# Altium project XDS100V2.PrjPcb
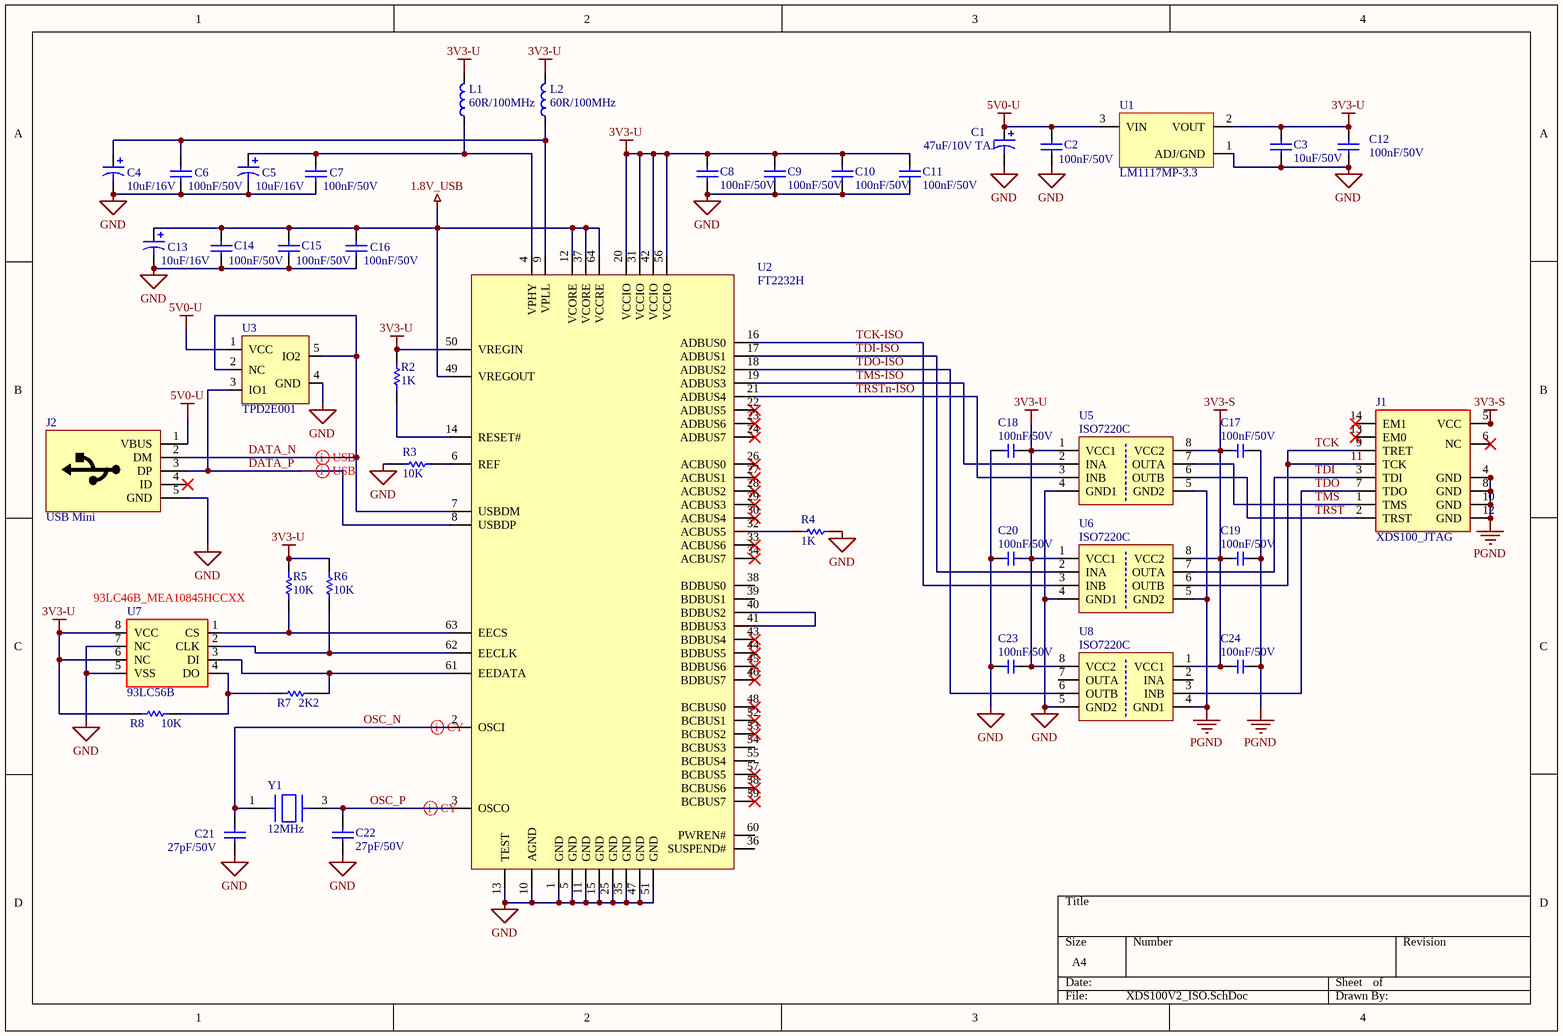
[diagram p0: XDS100V2_ISO.SchDoc]
1 sheet, 43 parts. Net scope: global (net labels, ports and power ports of the same name join across sheets).
Board file: PCB.PcbDoc

## Sheet XDS100V2_ISO.SchDoc
size A4

### Parts
C1  47uF/10V TAJ  [TAJ]
C2  100nF/50V  [CC0805]
C3  10uF/50V  [CC0805]
C4  10uF/16V  [Tantaium Cap A]
C5  10uF/16V  [Tantaium Cap A]
C6  100nF/50V  [CC0805]
C7  100nF/50V  [CC0805]
C8  100nF/50V  [CC0805]
C9  100nF/50V  [CC0805]
C10  100nF/50V  [CC0805]
C11  100nF/50V  [CC0805]
C12  100nF/50V  [CC0805]
C13  10uF/16V  [Tantaium Cap A]
C14  100nF/50V  [CC0805]
C15  100nF/50V  [CC0805]
C16  100nF/50V  [CC0805]
C17  100nF/50V  [CC0805]
C18  100nF/50V  [CC0805]
C19  100nF/50V  [CC0805]
C20  100nF/50V  [CC0805]
C21  27pF/50V  [CC0805]
C22  27pF/50V  [CC0805]
C23  100nF/50V  [CC0805]
C24  100nF/50V  [CC0805]
J1  XDS100_JTAG  [XDS100_JTAG]
J2  USB Mini  [USB_MINI]
L1  60R/100MHz  [CL0805]
L2  60R/100MHz  [CL0805]
R2  1K  [CR0805]
R3  10K  [CR0805]
R4  1K  [CR0805]
R5  10K  [CR0805]
R6  10K  [CR0805]
R7  2K2  [CR0805]
R8  10K  [CR0805]
U1  LM1117MP-3.3  [SOT223]
U2  FT2232H  [LQFP-64]
U3  TPD2E001  [DRL(R-PDSO-N5)]
U5  ISO7220C  [SOIC08]
U6  ISO7220C  [SOIC08]
U7  93LC56B  [SOIC08]
U8  ISO7220C  [SOIC08]
Y1  12MHz  [EXC3225]

### Nets
1.8V_USB: C13.1(DC+) C14.2 C15.2 C16.2 U2.12(VCORE) U2.37(VCORE) U2.49(VREGOUT) U2.64(VCCRE)
3V3-S: C17.1 C19.1 C24.1 J1.5(VCC) U5.8(VCC2) U6.8(VCC2) U8.1(VCC1)
3V3-U: C3.2 C8.2 C9.2 C10.2 C11.2 C12.2 C18.2 C20.2 C23.2 L1.2 L2.2 R2.2 R5.2 R6.2 R8.1 U1.2(VOUT) U2.20(VCCIO) U2.31(VCCIO) U2.42(VCCIO) U2.50(VREGIN) U2.56(VCCIO) U5.1(VCC1) U6.1(VCC1) U7.6(NC) U7.8(VCC) U8.8(VCC2)
5V0-U: C1.1 C2.2 J2.1(VBUS) U1.3(VIN) U3.1(VCC)
GND: C1.2 C2.1 C3.1 C4.2(DC-) C5.2(DC-) C6.1 C7.1 C8.1 C9.1 C10.1 C11.1 C12.1 C13.2(DC-) C14.1 C15.1 C16.1 C18.1 C20.1 C21.1 C22.1 C23.1 J2.0(SH) J2.5(GND) R3.2 R4.2 U1.1(ADJ/GND) U2.1(GND) U2.5(GND) U2.10(AGND) U2.11(GND) U2.13(TEST) U2.15(GND) U2.25(GND) U2.35(GND) U2.47(GND) U2.51(GND) U3.4(GND) U5.4(GND1) U6.4(GND1) U7.5(VSS) U7.7(NC) U8.5(GND2)
PGND: C17.2 C19.2 C24.2 J1.4(GND) J1.8(GND) J1.10(GND) J1.12(GND) U5.5(GND2) U6.5(GND2) U8.4(GND1)
DATA_N: J2.2(DM) U2.7(USBDM) U3.2(NC) U3.5(IO2)
DATA_P: J2.3(DP) U2.8(USBDP) U3.3(IO1)
OSC_N: C21.2 U2.2(OSCI) Y1.1
OSC_P: C22.2 U2.3(OSCO) Y1.3
TCK: J1.9(TRET) J1.11(TCK) U6.6(OUTB)
TCK-ISO: U2.16(ADBUS0) U6.3(INB)
TDI: J1.3(TDI) U6.7(OUTA)
TDI-ISO: U2.17(ADBUS1) U6.2(INA)
TDO: J1.7(TDO) U8.3(INB)
TDO-ISO: U2.18(ADBUS2) U8.6(OUTB)
TMS: J1.1(TMS) U5.7(OUTA)
TMS-ISO: U2.19(ADBUS3) U5.2(INA)
TRST: J1.2(TRST) U5.6(OUTB)
TRSTn-ISO: U2.21(ADBUS4) U5.3(INB)
NetC4_1: C4.1(DC+) C6.2 L2.1 U2.9(VPLL)
NetC5_1: C5.1(DC+) C7.2 L1.1 U2.4(VPHY)
NetR2_1: R2.1 U2.14(RESET#)
NetR3_1: R3.1 U2.6(REF)
NetR4_1: R4.1 U2.32(ACBUS5)
NetR5_1: R5.1 U2.63(EECS) U7.1(CS)
NetR6_1: R6.1 U2.62(EECLK) U7.2(CLK)
NetR7_1: R7.1 R8.2 U7.4(DO)
NetR7_2: R7.2 U2.61(EEDATA) U7.3(DI)
NetU2_40: U2.40(BDBUS2) U2.41(BDBUS3)

Not connected (* = marked no-connect by the designer): J1 6(NC)* 13(EM0)* 14(EM1)*; J2 4(ID)*; U2 22(ADBUS5)* 23(ADBUS6)* 24(ADBUS7)* 26(ACBUS0)* 27(ACBUS1)* 28(ACBUS2)* 29(ACBUS3)* 30(ACBUS4)* 33(ACBUS6)* 34(ACBUS7)* 36(SUSPEND#) 38(BDBUS0) 39(BDBUS1) 43(BDBUS4)* 44(BDBUS5)* 45(BDBUS6)* 46(BDBUS7)* 48(BCBUS0)* 52(BCBUS1)* 53(BCBUS2)* 54(BCBUS3) 55(BCBUS4) 57(BCBUS5)* 58(BCBUS6)* 59(BCBUS7)* 60(PWREN#); U8 2(INA) 7(OUTA)

### Layout directives
differential pair: DATA_N, DATA_P, OSC_N, OSC_P

### Notes on the sheet
- (near U7) 93LC46B_MEA10845HCCXX

### Library data of the parts
C1 = 47uF/10V TAJ: Polarized Capacitor (Axial); Data Sheet: TAJ.pdf; SSTC PN.: MEC30041XRXX; MA.: *; Price (NTD): 2.99; Component Type: tantalum solid electrolytic capacitors; Package: *; MA.2: *; Value: 47uF/10V TAJ
C2 C6-C11 C14-C20 C23 C24 = 100nF/50V: Capacitor (Semiconductor SIM Model); SSTC PN.: MEC00390YDXX; Data Sheet: CC.pdf; MA.: *; Price (NTD): 0.08; Package: SMA0805; MA.2: *; Component Type: chip capacitors; Value: 100nF/50V
C3 = 10uF/50V: Capacitor (Semiconductor SIM Model); Data Sheet: CC.pdf; MA.: *; Price (NTD): *; Package: SMA0805; MA.2: *; SSTC PN.: *; Component Type: chip capacitors; Value: 10uF/50V
C4 C5 C13 = 10uF/16V: Polarized Capacitor (Axial); SSTC PN.: MEC300113CXX; Data Sheet: Tantalum Capactor.pdf; Package: SMA A class; Price (NTD): 1.5; MA.2: *; MA.: *; Component Type: tantalum solid electrolytic capacitors; Value: 10uF/16V
C12 = 100nF/50V: Capacitor (Semiconductor SIM Model); Data Sheet: CC.pdf; MA.: *; Price (NTD): *; Package: SMA0805; MA.2: *; SSTC PN.: *; Component Type: chip capacitors; Value: 100nF/50V
C21 C22 = 27pF/50V: Capacitor (Semiconductor SIM Model); Data Sheet: CC.pdf; MA.: *; Price (NTD): *; Package: SMA0805; MA.2: *; SSTC PN.: *; Component Type: chip capacitors; Value: 27pF/50V
J1 = XDS100_JTAG: Data Sheet: �ȭZ2.54�ưw���y.pdf; MA.: �ȭZ; Price (NTD): *; MA.2: *; SSTC PN.: *; Package: *; Component Type: Connector; Value: XDS100_JTAG
J2 = USB Mini: Data Sheet: mini usb spec.pdf; MA.: �ȼw��; SSTC PN.: MEX1134GH0XX; Component Type: Connector; MA. 2: *; Package: SMA; Price (NTD): 3.6; Value: USB Mini
L1 L2 = 60R/100MHz: Inductor; SSTC PN.: MEI0020NN8XX; Data Sheet: BKP2125HS600P.pdf; MA.: BKP2125HS600-T; Package: SMA 0805; Price (NTD): 0.18; MA.2: *; Component Type: Inductor; Value: 60R/100MHz
R2 R4 = 1K: Resistor; SSTC PN.: MER1022K66XX; Data Sheet: CR.pdf; Price (NTD): 0.04; Package: SMA 0805; MA.: *; MA.2: *; Component Type: chip resistor; Value: 1K
R3 R5 R6 R8 = 10K: Resistor; SSTC PN.: MER1106K6CXX; Data Sheet: CR.pdf; Price (NTD): 0.03; Package: SMA 0805; MA.: *; MA.2: *; Component Type: chip resistor; Value: 10K
R7 = 2K2: Resistor; Data Sheet: CR.pdf; SSTC PN.: *; Price (NTD): 0.03; Package: SMA0805; MA.: *; MA.2: *; Component Type: chip resistor; Value: 2K2
U1 = LM1117MP-3.3: MA.: �����; SSTC PN.: MEA109164JXX; Data Sheet: LM1117MP-3.3.pdf; Package: SOT223; Price (NTD): 12.58; MA.2: *; Component Type: Reference; Value: LM1117MP-3.3
U2 = FT2232H: Data Sheet: DS_FT2232H.pdf; Component Type: USB TO MULTIPURPOSE UART/FIFO IC; MA.: *; MA. 2: *; Package: LQFP 64; Price (NTD): *; SSTC PN.: *; Value: FT2232H
U3 = TPD2E001: Data Sheet: tpd2e001.PDF; Price (NTD): *; MA.2: *; SSTC PN.: *; Component Type: ESD-Protection for High-Speed Data Interfaces; MA.: *; Package: SOT-5; Value: TPD2E001
U5 U6 U8 = ISO7220: Data Sheet: ISO7220.pdf; Component Type: DUAL DIGITAL ISOLATORS; Package: SOIC 08; MA.: *; Price (NTD): *; SSTC PN.: *; MA.2: *; Value: ISO7220C
U7 = 93C56: EEPROM; Data Sheet: 93C56.pdf; MA.: *; MA.2: *; Price (NTD): *; SSTC PN.: *; Package: SOIC08; Component Type: Memory; Value: 93LC56B
Y1 = 12MHz Crystal/4pin: Crystal; Data Sheet: ecx_53b.pdf; Price (NTD): *; MA.2: *; SSTC PN.: *; Package: SMD; MA.: *; Component Type: Crystal; Value: 12MHz